# Altium schematic sheet INPUT.SchDoc
size A4; SheetNumber: 2; SheetTotal: 9
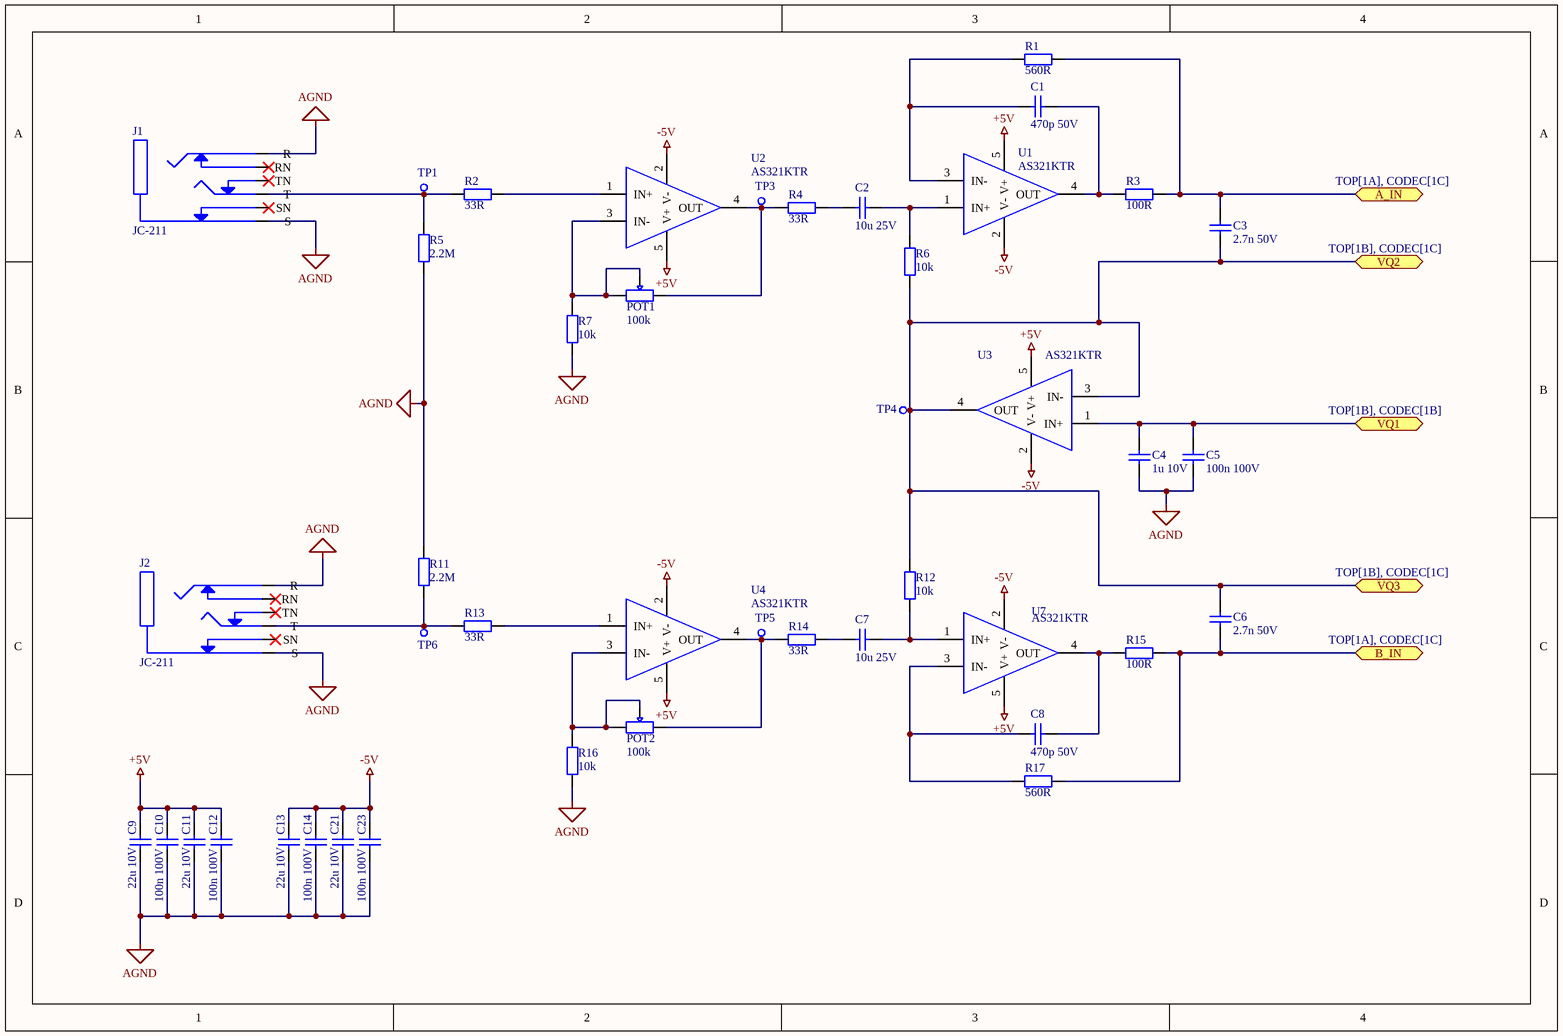
[diagram p0: INPUT.SchDoc]

## Parts
C1  470p 50V  [CAPACITOR 0805]
C2  10u 25V  [CAPACITOR 0805]
C3  2.7n 50V  [CAPACITOR 0805]
C4  1u 10V  [CAPACITOR 0805]
C5  100n 100V  [CAPACITOR 0805]
C6  2.7n 50V  [CAPACITOR 0805]
C7  10u 25V  [CAPACITOR 0805]
C8  470p 50V  [CAPACITOR 0805]
C9  22u 10V  [CAPACITOR 0805]
C10  100n 100V  [CAPACITOR 0805]
C11  22u 10V  [CAPACITOR 0805]
C12  100n 100V  [CAPACITOR 0805]
C13  22u 10V  [CAPACITOR 0805]
C14  100n 100V  [CAPACITOR 0805]
C21  22u 10V  [CAPACITOR 0805]
C23  100n 100V  [CAPACITOR 0805]
J1  JC-211  [AMPHENOL ACJM-MHDR]
J2  JC-211  [AMPHENOL ACJM-MHDR]
POT1  100k  [POTENTIOMETER 3362P]
POT2  100k  [POTENTIOMETER 3362P]
R1  560R  [RESISTOR 0805]
R2  33R  [RESISTOR 0805]
R3  100R  [RESISTOR 0805]
R4  33R  [RESISTOR 0805]
R5  2.2M  [RESISTOR 0805]
R6  10k  [RESISTOR 0805]
R7  10k  [RESISTOR 0805]
R11  2.2M  [RESISTOR 0805]
R12  10k  [RESISTOR 0805]
R13  33R  [RESISTOR 0805]
R14  33R  [RESISTOR 0805]
R15  100R  [RESISTOR 0805]
R16  10k  [RESISTOR 0805]
R17  560R  [RESISTOR 0805]
TP1  1mm  [TEST POINT 1MM]  (value not drawn)
TP3  1mm  [TEST POINT 1MM]  (value not drawn)
TP4  1mm  [TEST POINT 1MM]  (value not drawn)
TP5  1mm  [TEST POINT 1MM]  (value not drawn)
TP6  1mm  [TEST POINT 1MM]  (value not drawn)
U1  AS321KTR  [SOT23-5]
U2  AS321KTR  [SOT23-5]
U3  AS321KTR  [SOT23-5]
U4  AS321KTR  [SOT23-5]
U7  AS321KTR  [SOT23-5]

## Ports
A_IN (bidir, see TOP[1A], CODEC[1C]), B_IN (bidir, see TOP[1A], CODEC[1C]), VQ1 (bidir, see TOP[1B], CODEC[1B]), VQ2 (bidir, see TOP[1B], CODEC[1C]), VQ3 (bidir, see TOP[1B], CODEC[1C])

## Nets
+5V: C9.2 C10.2 C11.2 C12.2 U1.5(V+) U2.5(V+) U3.5(V+) U4.5(V+) U7.5(V+)
-5V: C13.2 C14.2 C21.2 C23.2 U1.2(V-) U2.2(V-) U3.2(V-) U4.2(V-) U7.2(V-)
AGND: C4.1 C5.1 C9.1 C10.1 C11.1 C12.1 C13.1 C14.1 C21.1 C23.1 J1.1(S) J1.2(R) J2.1(S) J2.2(R) R5.1 R7.1 R11.2 R16.1
A_IN: C3.2 R1.2 R3.2 ; port A_IN
B_IN: C6.2 R15.2 R17.2 ; port B_IN
VQ1: C4.2 C5.2 U3.1(IN+) ; port VQ1
VQ2: C3.1 C6.1 R6.1 R12.1 TP4.1 U3.3(IN-) U3.4(OUT) ; port VQ2, port VQ3
NetC1_1: C1.1 R1.1 U1.3(IN-)
NetC1_2: C1.2 R3.1 U1.4(OUT)
NetC2_1: C2.1 R4.2
NetC2_2: C2.2 R6.2 U1.1(IN+)
NetC7_1: C7.1 R14.2
NetC7_2: C7.2 R12.2 U7.1(IN+)
NetC8_1: C8.1 R17.1 U7.3(IN-)
NetC8_2: C8.2 R15.1 U7.4(OUT)
NetJ1_3: J1.3(T) R2.1 R5.2 TP1.1
NetJ2_3: J2.3(T) R11.1 R13.1 TP6.1
NetPOT1_1: POT1.1 POT1.2 R7.2 U2.3(IN-)
NetPOT1_3: POT1.3 R4.1 TP3.1 U2.4(OUT)
NetPOT2_1: POT2.1 POT2.2 R16.2 U4.3(IN-)
NetPOT2_3: POT2.3 R14.1 TP5.1 U4.4(OUT)
NetR2_2: R2.2 U2.1(IN+)
NetR13_2: R13.2 U4.1(IN+)

Not connected (* = marked no-connect by the designer): J1 4(TN)* 5(RN)* 6(SN)*; J2 4(TN)* 5(RN)* 6(SN)*

## Library data of the parts
C1 C8 = Capacitor 470p 50V 10% X7R 0805: Capacitor: ceramic; MLCC; 470pF; 50V; X7R; ±10%; SMD; 0805; Manufacturer: KEMET; Manufacturer Part Number: C0805C471K5RAC; ComponentLink1Description: Datasheet; ComponentLink1URL: https://www.tme.eu/Document/8b10290897269af8f8558c697aa8fd11/C0805C471K5RACTU.pdf; Footprint: Capacitor 0805; Price 10pcs [$]: 0.01970; Supplier: TME
C2 C7 = Capacitor 10u 25V 10% X5R 0805: Capacitor: ceramic; MLCC; 10uF; 25V; X5R; ±10%; SMD; 0805; Manufacturer: MURATA; Manufacturer Part Number: GRM21BR61E106KA73K; ComponentLink1Description: Datasheet; ComponentLink1URL: https://www.tme.eu/Document/58bb7db4269ac3ad53d1aa3c0ade9bab/GRM.pdf; Footprint: Capacitor 0805; Price 10pcs [$]: 0.0784; Supplier: TME
C3 C6 = Capacitor 2.7n 50V ±2% X7R 0805: Capacitor: ceramic; MLCC; 2.7nF; 50V; X7R; ±10%; SMD; 0805; Manufacturer: KYOCERA AVX; Manufacturer Part Number: 08055C272KAT2A; ComponentLink1Description: Datasheet; ComponentLink1URL: https://www.tme.eu/Document/78f46414e6dac38b7cca12338ea208b0/X7RDielectric.pdf; Price 10pcs [$]: 0.0680; Supplier: TME
C4 = Capacitor 1u 10V 10% X7R 0805: Capacitor: ceramic; MLCC; 1uF; 10V; X7R; ±10%; SMD; 0805; Manufacturer: YAGEO; Manufacturer Part Number: CC0805KKX7R6BB105; ComponentLink1Description: Datasheet; ComponentLink1URL: https://www.tme.eu/Document/fbb9415081fcefba62c0f8bbf5b21210/UPY-GPHC_X7R_6.3V-to-50V_20.pdf; Footprint: Capacitor 0805; Price 10pcs [$]: 0.0770; Supplier: TME
C5 C10 C12 C14 C23 = Capacitor 100n 100V 10% X7R 0805: Capacitor: ceramic; MLCC; 100nF; 100V; X7R; ±10%; SMD; 0805; Manufacturer: YAGEO; Manufacturer Part Number: CC0805KKX7R0BB104; ComponentLink1Description: Datasheet; ComponentLink1URL: https://www.tme.eu/Document/fbb9415081fcefba62c0f8bbf5b21210/UPY-GPHC_X7R_6.3V-to-50V_20.pdf; Footprint: Capacitor 0805; Price 10pcs [$]: 0.0770; Supplier: TME
C9 C11 C13 C21 = Capacitor 22u 10V 20% X5R 0805: Capacitor: ceramic; 22uF; 10V; X5R; ±20%; SMD; 0805; Manufacturer: SAMSUNG; Manufacturer Part Number: CL21A226MPQNNNE; ComponentLink1Description: Datasheet; ComponentLink1URL: https://www.tme.eu/Document/7da762c1dbaf553c64ad9c40d3603826/mlcc_samsung.pdf; Footprint: Capacitor 0805; Price 10pcs [$]: 0.0490; Supplier: TME
J1 J2 = Mechanical Jack 6.3mm Socket PCB THT JC-211: Socket; Jack 6,3mm; female; mono; ways: 2; for panel mounting; THT; Manufacturer: NINIGI; ComponentLink1Description: Datasheet; ComponentLink1URL: https://www.tme.eu/html/EN/connector-jack-6-3mm-socket/ramka_770_EN_pelny.html; Manufacturer Part Number: JC-211; Price 10pcs [$]: 0.581; Supplier: TME
POT1 POT2 = Potentiometer Trimmer 100k THT 3362P: Trimmer Resistors - Through Hole 1/4"SQ 100KOHMS 10% 0.5WATTS; Manufacturer: Bourns; Manufacturer Part Number: 3362P-1-104LF; ComponentLink1Description: Datasheet; ComponentLink1URL: https://www.mouser.pl/datasheet/2/54/3362-776956.pdf; Footprint: Potentiometer 3362P; Price 10pcs [$]: 0.909; Supplier: Mouser
R1 R17 = Resistor 560R 1% 1/8W 0805: Resistor: thick film; SMD; 0805; 560Ω; 0.125W; ±1%; -55÷155°C; Manufacturer: Yageo; Manufacturer Part Number: RC0805FR-07560R; ComponentLink1Description: Datasheet; ComponentLink1URL: https://www.tme.eu/Document/7b8fed8c112f8a94930279c22c957f7f/rc0805yageo.pdf; Footprint: Resistor 0805; Price 10pcs [$]: 0.023; Supplier: TME
R2 R4 R13 R14 = Resistor 33R 1% 1/8W 0805: Resistor: thick film; SMD; 0805; 33Ω; 0.125W; ±1%; -55÷155°C; Manufacturer: Yageo; Manufacturer Part Number: RC0805FR-0733R; ComponentLink1Description: Datasheet; ComponentLink1URL: https://www.tme.eu/Document/7b8fed8c112f8a94930279c22c957f7f/rc0805yageo.pdf; Footprint: Resistor 0805; Price 10pcs [$]: 0.023; Supplier: TME
R3 R15 = Resistor 100R 1% 1/8W 0805: Resistor: thick film; SMD; 0805; 100Ω; 0.125W; ±1%; -55÷155°C; Manufacturer: Yageo; Manufacturer Part Number: RC0805FR-07100R; ComponentLink1Description: Datasheet; ComponentLink1URL: https://www.tme.eu/Document/7b8fed8c112f8a94930279c22c957f7f/rc0805yageo.pdf; Footprint: Resistor 0805; Price 10pcs [$]: 0.023; Supplier: TME
R5 R11 = Resistor 2.2M 5% 1/8W 0805: Resistor: thick film; SMD; 0805; 2.2MΩ; 0.125W; ±5%; -55÷155°C; Manufacturer: Yageo; Manufacturer Part Number: RC0805JR-072M2; ComponentLink1Description: Datasheet; ComponentLink1URL: https://www.tme.eu/Document/7b8fed8c112f8a94930279c22c957f7f/rc0805yageo.pdf; Price 10pcs [$]: 0.016; Supplier: TME
R6 R7 R12 R16 = Resistor 10k 1% 1/8W 0805: Resistor: thick film; SMD; 0805; 10kΩ; 0.125W; ±1%; -55÷155°C; Manufacturer: Yageo; Manufacturer Part Number: RC0805FR-0710K; ComponentLink1Description: Datasheet; ComponentLink1URL: https://www.tme.eu/Document/7b8fed8c112f8a94930279c22c957f7f/rc0805yageo.pdf; Price 10pcs [$]: 0.016; Supplier: TME
TP1 TP3-TP6 = Mechanical Test Point 1mm: Tesp Point 1mm; ComponentLink1Description: Datasheet; ComponentLink1URL: -; Manufacturer: -; Manufacturer Part Number: -; Footprint: -; Price 10pcs [$]: -; Supplier: -
U1-U4 U7 = IC Op-Amp Single AS321KTR SOT23-5: IC: operational amplifier; 3÷36V; Ch: 1; SOT23-5; reel,tape; Manufacturer: DIODES INCORPORATED; Manufacturer Part Number: AS321KTR-G1; ComponentLink1Description: Datasheet; ComponentLink1URL: https://www.tme.eu/Document/ff04728045a484fb1c57ffb6d73e1bf1/AS321.pdf; Footprint: SOIC-8; Price 10pcs [$]: 0.214; Supplier: TME